# EAGLE design Matrix Clock (EAGLE 6.5.0)
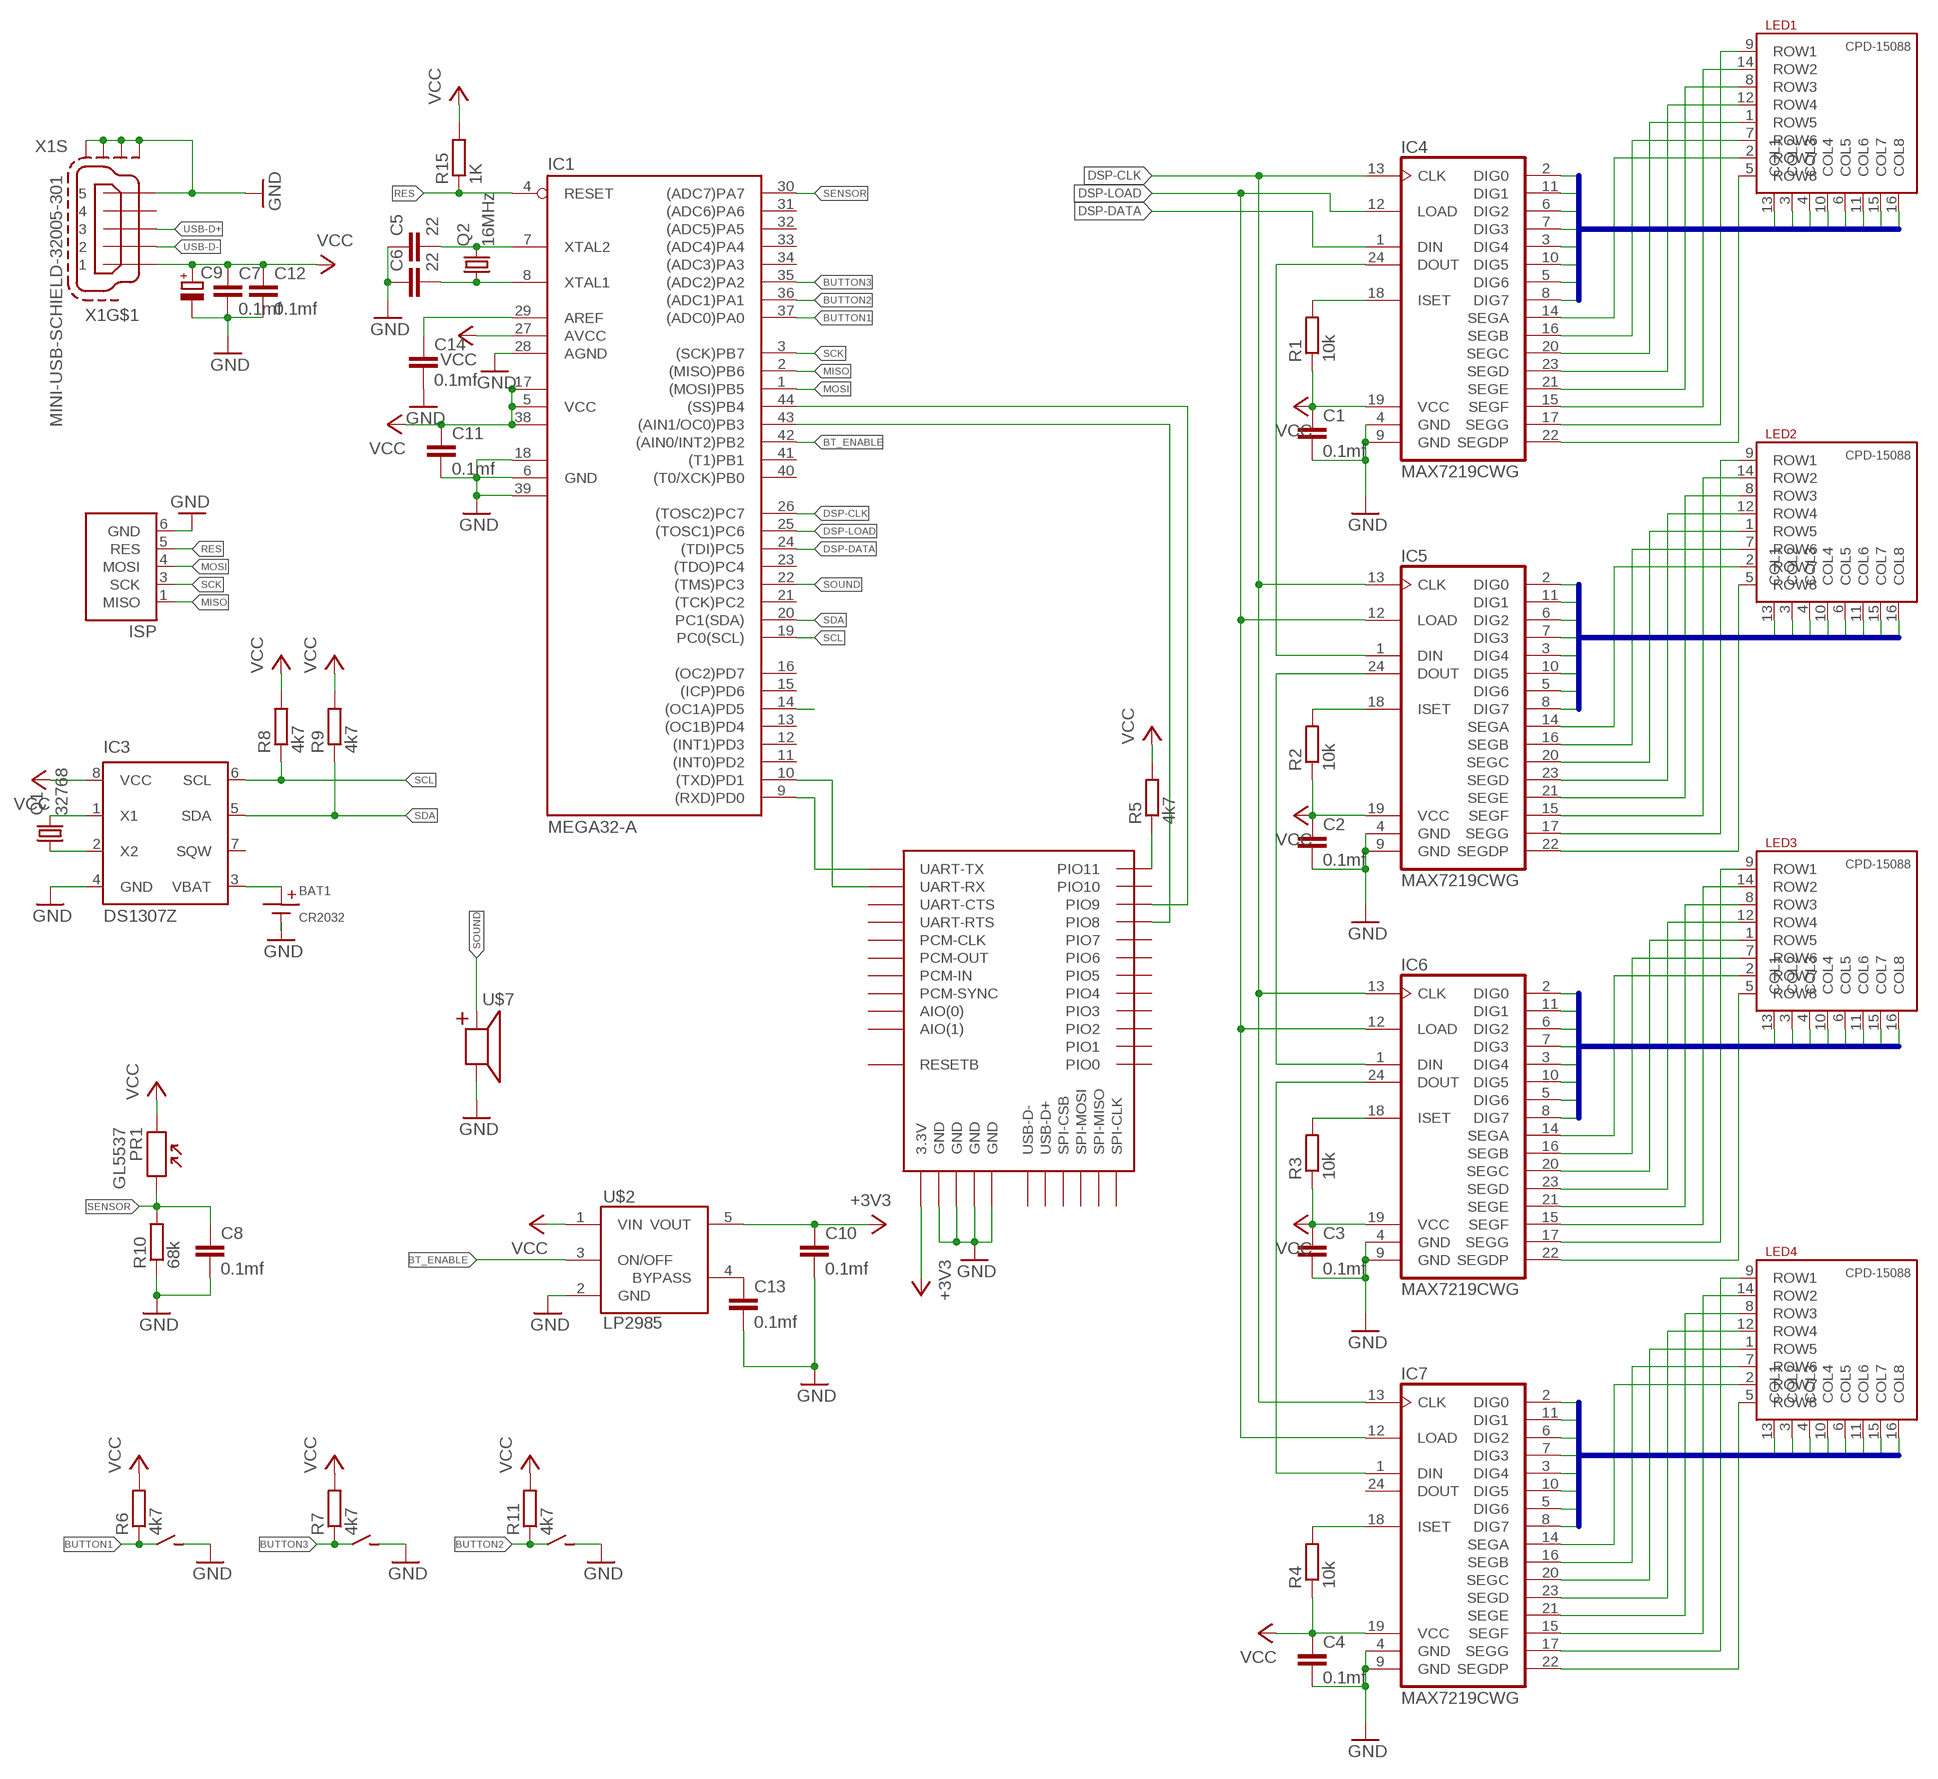
[diagram p0: schematic, sheet 1]

## Parts
BAT1  CR2032  [CR2032-SMD]
C1  0.1mf  C-EUC0805  [C0805]
C2  0.1mf  C-EUC0805  [C0805]
C3  0.1mf  C-EUC0805  [C0805]
C4  0.1mf  C-EUC0805  [C0805]
C5  22  C-EUC0805  [C0805]
C6  22  C-EUC0805  [C0805]
C7  0.1mf  C-EUC0805  [C0805]
C8  0.1mf  C-EUC0805  [C0805]
C9  CPOL-EU153CLV-0605  [153CLV-0605]
C10  0.1mf  C-EUC0805  [C0805]
C11  0.1mf  C-EUC0805  [C0805]
C12  0.1mf  C-EUC0805  [C0805]
C13  0.1mf  C-EUC0805  [C0805]
C14  0.1mf  C-EUC0805  [C0805]
IC1  MEGA32-A  [TQFP44]
IC3  DS1307Z  [SOIC8]
IC4  MAX7219CWG  [SO24L]
IC5  MAX7219CWG  [SO24L]
IC6  MAX7219CWG  [SO24L]
IC7  MAX7219CWG  [SO24L]
LED1  CPD-15088YGD2/A  [CPD15088]
LED2  CPD-15088YGD2/A  [CPD15088]
LED3  CPD-15088YGD2/A  [CPD15088]
LED4  CPD-15088YGD2/A  [CPD15088]
PR1  GL5537  [GL55]
Q1  32768  CRYSTALTC38H  [TC38H]
Q2  16MHz  CRYSTALHC49S  [HC49/S]
R1  10k  R-EU_R0805  [R0805]
R2  10k  R-EU_R0805  [R0805]
R3  10k  R-EU_R0805  [R0805]
R4  10k  R-EU_R0805  [R0805]
R5  4k7  R-EU_R0805  [R0805]
R6  4k7  R-EU_R0805  [R0805]
R7  4k7  R-EU_R0805  [R0805]
R8  4k7  R-EU_R0805  [R0805]
R9  4k7  R-EU_R0805  [R0805]
R10  68k  R-EU_R0805  [R0805]
R11  4k7  R-EU_R0805  [R0805]
R15  1K  R-EU_R0805  [R0805]
U$1  BTM400_6B  [BTM400_6B]
U$2  LP2985AIM5-3.3  [SOT25]
U$3  AVR-ISP  [AVR-ISP]
U$7  HC0905  [HC0905]
U$9  IT1188E  [IT1188E]
U$10  IT1188E  [IT1188E]
U$11  IT1188E  [IT1188E]
X1  MINI-USB-SCHIELD-32005-301  [32005-301]

## Nets
+3V3 [VCC]: C10.1 U$1.3.3V U$2.5(VOUT)
BT_ENABLE: IC1.42((AIN0/INT2)PB2) U$2.3(ON/OFF)
BUTTON1: IC1.37((ADC0)PA0) R6.1 U$9.3
BUTTON2: IC1.36((ADC1)PA1) R11.1 U$10.3
BUTTON3: IC1.14((OC1A)PD5) IC1.35((ADC2)PA2) R7.1 U$11.3
BYPASS: C13.1 U$2.4(BYPASS)
C0 [LED]: IC4.2(DIG0) LED1.13(COL1)
C1 [LED]: IC4.11(DIG1) LED1.3(COL2)
C2 [LED]: IC4.6(DIG2) LED1.4(COL3)
C3 [LED]: IC4.7(DIG3) LED1.10(COL4)
C4 [LED]: IC4.3(DIG4) LED1.6(COL5)
C5 [LED]: IC4.10(DIG5) LED1.11(COL6)
C6 [LED]: IC4.5(DIG6) LED1.15(COL7)
C7 [LED]: IC4.8(DIG7) LED1.16(COL8)
C8 [LED]: IC5.2(DIG0) LED2.13(COL1)
C9 [LED]: IC5.11(DIG1) LED2.3(COL2)
C10 [LED]: IC5.6(DIG2) LED2.4(COL3)
C11 [LED]: IC5.7(DIG3) LED2.10(COL4)
C12 [LED]: IC5.3(DIG4) LED2.6(COL5)
C13 [LED]: IC5.10(DIG5) LED2.11(COL6)
C14 [LED]: IC5.5(DIG6) LED2.15(COL7)
C15 [LED]: IC5.8(DIG7) LED2.16(COL8)
C16 [LED]: IC6.2(DIG0) LED3.13(COL1)
C17 [LED]: IC6.11(DIG1) LED3.3(COL2)
C18 [LED]: IC6.6(DIG2) LED3.4(COL3)
C19 [LED]: IC6.7(DIG3) LED3.10(COL4)
C20 [LED]: IC6.3(DIG4) LED3.6(COL5)
C21 [LED]: IC6.10(DIG5) LED3.11(COL6)
C22 [LED]: IC6.5(DIG6) LED3.15(COL7)
C23 [LED]: IC6.8(DIG7) LED3.16(COL8)
C24 [LED]: IC7.2(DIG0) LED4.13(COL1)
C25 [LED]: IC7.11(DIG1) LED4.3(COL2)
C26 [LED]: IC7.6(DIG2) LED4.4(COL3)
C27 [LED]: IC7.7(DIG3) LED4.10(COL4)
C28 [LED]: IC7.3(DIG4) LED4.6(COL5)
C29 [LED]: IC7.10(DIG5) LED4.11(COL6)
C30 [LED]: IC7.5(DIG6) LED4.15(COL7)
C31 [LED]: IC7.8(DIG7) LED4.16(COL8)
DSP-CLK: IC1.26((TOSC2)PC7) IC4.13(CLK) IC5.13(CLK) IC6.13(CLK) IC7.13(CLK)
DSP-DATA: IC1.24((TDI)PC5) IC4.1(DIN)
DSP-LOAD: IC1.25((TOSC1)PC6) IC4.12(LOAD) IC5.12(LOAD) IC6.12(LOAD) IC7.12(LOAD)
GND [GND]: BAT1.-(GND) C1.2 C2.2 C3.2 C4.2 C5.1 C6.1 C7.2 C8.2 C9.- C10.2 C11.2 C12.2 C13.2 C14.2 IC1.6(GND) IC1.18(GND1) IC1.28(AGND) IC1.39(GND2) IC3.4(GND) IC4.4(GND) IC4.9(GND) IC5.4(GND) IC5.9(GND) IC6.4(GND) IC6.9(GND) IC7.4(GND) IC7.9(GND) R10.1 U$1.GND@1(GND) U$1.GND@2(GND) U$1.GND@3(GND) U$1.GND@4(GND) U$2.2(GND) U$3.6(GND) U$7.P$1 U$9.4 U$10.4 U$11.4 X1.5 X1.M1(S:S1) X1.M2(S:S2) X1.M3(S:S3) X1.M4(S:S4)
MISO: IC1.2((MISO)PB6) U$3.1(MISO)
MOSI: IC1.1((MOSI)PB5) U$3.4(MOSI)
N$1 [LED]: IC4.22(SEGDP) LED1.5(ROW8)
N$2 [VCC]: IC4.18(ISET) R1.2
N$3: BAT1.+(VBAT) IC3.3(VBAT)
N$4: IC1.10((TXD)PD1) U$1.UART-RX
N$5: IC1.9((RXD)PD0) U$1.UART-TX
N$6 [LED]: IC4.17(SEGG) LED1.9(ROW1)
N$7 [LED]: IC4.15(SEGF) LED1.14(ROW2)
N$8 [LED]: IC4.21(SEGE) LED1.8(ROW3)
N$9 [LED]: IC4.23(SEGD) LED1.12(ROW4)
N$10 [LED]: IC4.20(SEGC) LED1.1(ROW5)
N$11 [LED]: IC4.16(SEGB) LED1.7(ROW6)
N$12 [LED]: IC4.14(SEGA) LED1.2(ROW7)
N$13 [VCC]: IC5.18(ISET) R2.2
N$14: IC5.24(DOUT) IC6.1(DIN)
N$15: IC6.24(DOUT) IC7.1(DIN)
N$16: IC4.24(DOUT) IC5.1(DIN)
N$17 [LED]: IC5.22(SEGDP) LED2.5(ROW8)
N$18 [LED]: IC5.17(SEGG) LED2.9(ROW1)
N$19 [LED]: IC5.15(SEGF) LED2.14(ROW2)
N$20 [LED]: IC5.21(SEGE) LED2.8(ROW3)
N$21 [LED]: IC5.23(SEGD) LED2.12(ROW4)
N$22 [LED]: IC5.20(SEGC) LED2.1(ROW5)
N$23 [LED]: IC5.16(SEGB) LED2.7(ROW6)
N$24 [LED]: IC5.14(SEGA) LED2.2(ROW7)
N$25 [VCC]: IC6.18(ISET) R3.2
N$26: IC1.44((SS)PB4) U$1.PIO(9)(PIO9)
N$27: IC1.43((AIN1/OC0)PB3) U$1.PIO(8)(PIO8)
N$28: R5.1 U$1.PIO(11)(PIO11)
N$29 [LED]: IC6.22(SEGDP) LED3.5(ROW8)
N$30 [LED]: IC6.17(SEGG) LED3.9(ROW1)
N$31 [LED]: IC6.15(SEGF) LED3.14(ROW2)
N$32 [LED]: IC6.21(SEGE) LED3.8(ROW3)
N$33 [LED]: IC6.23(SEGD) LED3.12(ROW4)
N$34 [LED]: IC6.20(SEGC) LED3.1(ROW5)
N$35 [LED]: IC6.16(SEGB) LED3.7(ROW6)
N$36 [LED]: IC6.14(SEGA) LED3.2(ROW7)
N$37 [VCC]: IC7.18(ISET) R4.2
N$41 [LED]: IC7.22(SEGDP) LED4.5(ROW8)
N$42 [LED]: IC7.17(SEGG) LED4.9(ROW1)
N$43 [LED]: IC7.15(SEGF) LED4.14(ROW2)
N$44 [LED]: IC7.21(SEGE) LED4.8(ROW3)
N$45 [LED]: IC7.23(SEGD) LED4.12(ROW4)
N$46 [LED]: IC7.20(SEGC) LED4.1(ROW5)
N$47 [LED]: IC7.16(SEGB) LED4.7(ROW6)
N$48 [LED]: IC7.14(SEGA) LED4.2(ROW7)
N$53: IC3.1(X1) Q1.2
N$54: IC3.2(X2) Q1.1
N$55: C14.1 IC1.29(AREF)
RES: IC1.4(RESET) R15.1 U$3.5(RES)
SCK: IC1.3((SCK)PB7) U$3.3(SCK)
SCL: IC1.19(PC0(SCL)) IC3.6(SCL) R8.1
SDA: IC1.20(PC1(SDA)) IC3.5(SDA) R9.1
SENSOR: C8.1 IC1.30((ADC7)PA7) PR1.P$2 R10.2
SOUND: IC1.22((TMS)PC3) U$7.P$2
USB-D+: X1.3
USB-D-: X1.2
VCC [VCC]: C1.1 C2.1 C3.1 C4.1 C7.1 C9.+ C11.1 C12.1 IC1.5(VCC) IC1.17(VCC1) IC1.27(AVCC) IC1.38(VCC2) IC3.8(VCC) IC4.19(VCC) IC5.19(VCC) IC6.19(VCC) IC7.19(VCC) PR1.P$1 R1.1 R2.1 R3.1 R4.1 R5.2 R6.2 R7.2 R8.2 R9.2 R11.2 R15.2 U$2.1(VIN) X1.1
XTAL1: C6.2 IC1.8(XTAL1) Q2.1
XTAL2: C5.2 IC1.7(XTAL2) Q2.2
Unconnected: IC1.11((INT0)PD2) IC1.12((INT1)PD3) IC1.13((OC1B)PD4) IC1.15((ICP)PD6) IC1.16((OC2)PD7) IC1.21((TCK)PC2) IC1.23((TDO)PC4) IC1.31((ADC6)PA6) IC1.32((ADC5)PA5) IC1.33((ADC4)PA4) IC1.34((ADC3)PA3) IC1.40((T0/XCK)PB0) IC1.41((T1)PB1) IC3.7(SQW) IC7.24(DOUT) U$1.AIO(0) U$1.AIO(1) U$1.PCM-CLK U$1.PCM-IN U$1.PCM-OUT U$1.PCM-SYNC U$1.PIO(0)(PIO0) U$1.PIO(1)(PIO1) U$1.PIO(2)(PIO2) U$1.PIO(3)(PIO3) U$1.PIO(4)(PIO4) U$1.PIO(5)(PIO5) U$1.PIO(6)(PIO6) U$1.PIO(7)(PIO7) U$1.PIO(10)(PIO10) U$1.RESETB U$1.SPI-CLK U$1.SPI-CSB U$1.SPI-MISO U$1.SPI-MOSI U$1.UART-CTS U$1.UART-RTS U$1.USB-D+ U$1.USB-D- X1.4

## Buses
C0,C1,C2,C3,C4,C5,C6,C7

## Library data of the parts
BAT1 = misc:CR2032: CR2032 Socket
C1-C8 C10-C14 = rcl:C-EU: CAPACITOR, European symbol
C9 = rcl:CPOL-EU: POLARIZED CAPACITOR, European symbol
IC1 = avr-7:MEGA32: MICROCONTROLLER 32 Kbytes FLASH 2 Kbytes SRAM 1 Kbytes EEPROM USART 8-channel 10 bit ADC
IC3 = ds1307_pcf8583:DS1307: I2C-Bus CLOCK/CALENDAR
IC4-IC7 = max7219:MAX7219CWG
LED1-LED4 = LED:CPD-15088: CPD-15088A YGD2/A Green 8x8 LED matrix
PR1 = misc:GL5537: GL5537 Photoresistor
Q1 = crystal:CRYSTAL: CRYSTAL; OC_FARNELL: unknown; OC_NEWARK: unknown
Q2 = crystal:CRYSTAL: CRYSTAL; OC_FARNELL: 1667008; OC_NEWARK: unknown
R1-R11 R15 = rcl:R-EU_: RESISTOR, European symbol
U$1 = bc417:BTM400_6B
U$2 = LP2985:LP2985: LP2985-N Micropower 150 mA Low-Noise Ultra Low-Dropout Regulator
U$3 = misc:AVR-ISP: ISP Socket for AVR microcontrollers
U$7 = misc:HC0905
U$9-U$11 = misc:IT1188E: IT1188E SMD Tact button
X1 = con-cypressindustries:MINI-USB-SCHIELD-: MINI USB-B Conector Source: www.cypressindustries.com; OC_FARNELL: unknown; OC_NEWARK: unknown

## Net classes
0 default: width 0.203 mm
1 VCC: width 0.5 mm
2 GND: width 0.5 mm
3 LED: width 0.254 mm

## Board
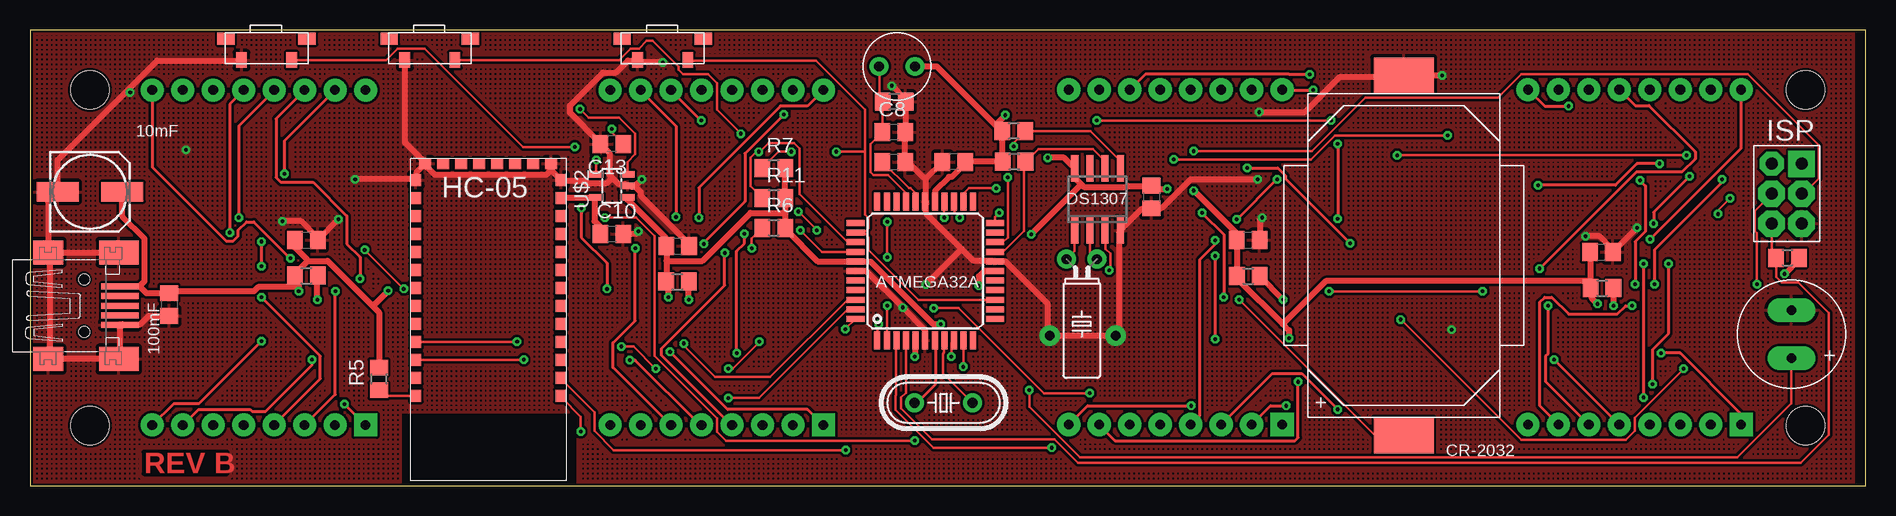
[diagram p1: board, top side]
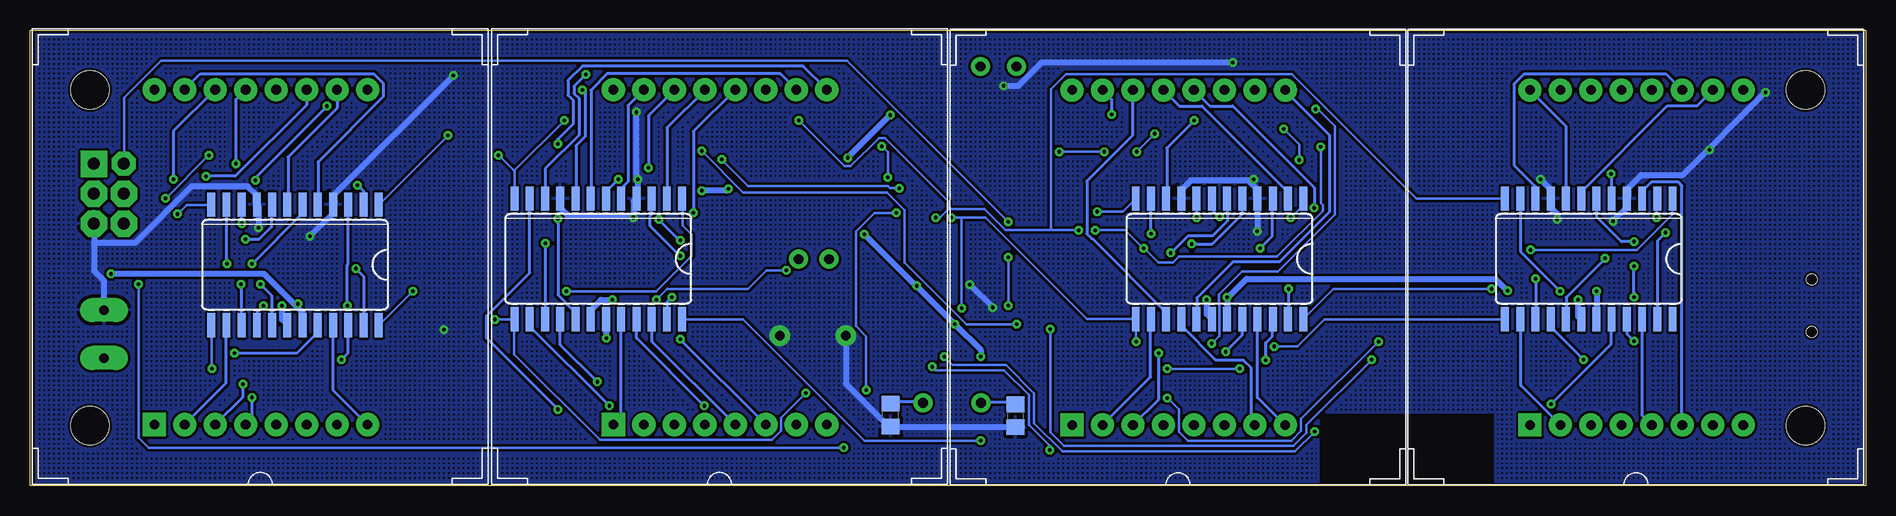
[diagram p2: board, bottom side, seen from below]

Size 153 x 38 mm. Coordinates in mm from the lower left corner, seen from the top.
Outline: 0,0 153,0 153,38 0,38 0,0
Copper layers (1*16): Top 0.035mm / dielectric 1.5mm / Bottom 0.035mm
Design rules "default": minimum track width 8mil, minimum drill 0.3mm, track to track 8mil, track to pad 8mil, pad to pad 8mil, via to via 8mil, smd to smd 0mil, copper to edge 0.2mm, drill to drill 1mm, minimum pad ring 15mil, minimum via ring 8mil, stop-mask expansion 4mil, vias tented up to drill 0mil, thermal gap 0.3mm
Holes 3.2 mm at 5,5 5,33 148,5 148,33
tRestrict: area 31,0 to 45.5,6
bRestrict: area 31,0 to 45.5,6

### Footprints (pad centres in the part's own frame; a part is rotated, then mirrored left to right if it is on the bottom)
CR2032-SMD = smd 3 x 5: + -14.2,0; - 15.8,0
C0805 = smd 1.3 x 1.5: 1 -0.95,0; 2 0.95,0
153CLV-0605 = smd 3.5 x 1.6: + 2.7,0; - -2.7,0
TQFP44 = smd 1.5 x 0.5: 1 -5.8,4; 2 -5.8,3.2; 3 -5.8,2.4; 4 -5.8,1.6; 5 -5.8,0.8; 6 -5.8,0; 7 -5.8,-0.8; 8 -5.8,-1.6; 9 -5.8,-2.4; 10 -5.8,-3.2; 11 -5.8,-4; 23 5.8,-4; 24 5.8,-3.2; 25 5.8,-2.4; 26 5.8,-1.6; 27 5.8,-0.8; 28 5.8,0; 29 5.8,0.8; 30 5.8,1.6; 31 5.8,2.4; 32 5.8,3.2; 33 5.8,4 | smd 0.5 x 1.5: 12 -4,-5.8; 13 -3.2,-5.8; 14 -2.4,-5.8; 15 -1.6,-5.8; 16 -0.8,-5.8; 17 0,-5.8; 18 0.8,-5.8; 19 1.6,-5.8; 20 2.4,-5.8; 21 3.2,-5.8; 22 4,-5.8; 34 4,5.8; 35 3.2,5.8; 36 2.4,5.8; 37 1.6,5.8; 38 0.8,5.8; 39 0,5.8; 40 -0.8,5.8; 41 -1.6,5.8; 42 -2.4,5.8; 43 -3.2,5.8; 44 -4,5.8
SOIC8 = smd 0.6 x 2.2: 1 -1.905,-2.6; 2 -0.635,-2.6; 3 0.635,-2.6; 4 1.905,-2.6; 5 1.905,2.6; 6 0.635,2.6; 7 -0.635,2.6; 8 -1.905,2.6
SO24L = smd 0.66 x 2.032: 1 -6.985,-5.029; 2 -5.715,-5.029; 3 -4.445,-5.029; 4 -3.175,-5.029; 5 -1.905,-5.029; 6 -0.635,-5.029; 7 0.635,-5.029; 8 1.905,-5.029; 9 3.175,-5.029; 10 4.445,-5.029; 11 5.715,-5.029; 12 6.985,-5.029; 13 6.985,5.029; 14 5.715,5.029; 15 4.445,5.029; 16 3.175,5.029; 17 1.905,5.029; 18 0.635,5.029; 19 -0.635,5.029; 20 -1.905,5.029; 21 -3.175,5.029; 22 -4.445,5.029; 23 -5.715,5.029; 24 -6.985,5.029
CPD15088 = drill 0.8 pad 1.93 square: 1 10.16,-33.02 | drill 0.8 pad 1.93: 2 12.7,-33.02; 3 15.24,-33.02; 4 17.78,-33.02; 5 20.32,-33.02; 6 22.86,-33.02; 7 25.4,-33.02; 8 27.94,-33.02; 9 27.94,-5.08; 10 25.4,-5.08; 11 22.86,-5.08; 12 20.32,-5.08; 13 17.78,-5.08; 14 15.24,-5.08; 15 12.7,-5.08; 16 10.16,-5.08
GL55 = drill 0.8: P$1 -1.5,0; P$2 1.5,0
TC38H = drill 0.813: 1 -1.27,0; 2 1.27,0
HC49/S = drill 0.813: 1 -2.413,0; 2 2.413,0
R0805 = smd 1.3 x 1.5: 1 -0.95,0; 2 0.95,0
BTM400_6B = smd 0.9 x 1: 3.3V -6.05,-10.16; AIO(0) -6.05,-5.66; AIO(1) -6.05,-7.16; GND@1 -6.05,-11.66; GND@4 6.05,-11.66; PCM-CLK -6.05,0.34; PCM-IN -6.05,-2.66; PCM-OUT -6.05,-1.16; PCM-SYNC -6.05,-4.16; PIO(0) 6.05,-10.16; PIO(1) 6.05,-8.66; PIO(2) 6.05,-7.16; PIO(3) 6.05,-5.66; PIO(4) 6.05,-4.16; PIO(5) 6.05,-2.66; PIO(6) 6.05,-1.16; PIO(7) 6.05,0.34; PIO(8) 6.05,1.84; PIO(9) 6.05,3.34; PIO(10) 6.05,4.84; PIO(11) 6.05,6.34; RESETB -6.05,-8.66; UART-CTS -6.05,3.34; UART-RTS -6.05,1.84; UART-RX -6.05,4.84; UART-TX -6.05,6.34 | smd 1 x 0.9: GND@2 -5.23,-13; GND@3 5.27,-13; SPI-CLK 2.27,-13; SPI-CSB -2.23,-13; SPI-MISO 0.77,-13; SPI-MOSI -0.73,-13; USB-D+ 3.77,-13; USB-D- -3.73,-13
SOT25 = smd 0.55 x 1.2: 1 -0.95,-1.3; 2 0,-1.3; 3 0.95,-1.3; 4 0.95,1.3; 5 -0.95,1.3
AVR-ISP = drill 1 pad 2 octagon: 1 0,2.5 | drill 1 pad 2.2 square: 2 2.5,2.5 | drill 1 pad 2.2 octagon: 3 0,0; 4 2.5,0; 5 0,-2.5; 6 2.5,-2.5
HC0905 = drill 0.8 pad 2 long: P$1 -2,0; P$2 2,0
IT1188E = smd 1.45 x 1: 1 -0.72,-0.9; 2 6.04,-0.9 | smd 0.9 x 1.3: 3 0.56,0.9; 4 4.74,0.9
32005-301 = smd 3.1 x 0.5: 1 3,1.6; 2 3,0.8; 3 3,0; 4 3,-0.8; 5 3,-1.6 | smd 2.5 x 2: M1 -3,-4.45; M2 -3,4.45 | smd 3.3 x 2: M3 2.9,4.45; M4 2.9,-4.45 | hole 0.9: 0,2.2; 0,-2.2

### Placement (x,y rotation side)
BAT1  114.52,18.4 90 top
C1  130.99,19.47 0 top
C2  101.54,20.47 0 top
C3  53.99,19.97 0 top
C4  23.04,20.47 0 top
C5  70.84,5.82 90 bottom
C6  81.26,5.87 90 bottom
C7  93.49,24.07 270 top
C8  72,29.5 0 top
C9  5,24.5 0 top
C10  48.5,21 0 top
C11  77,27 180 top
C12  11.6,15.1 270 top
C13  48.5,28.5 180 top
C14  72,27 0 top
IC1  74.62,17.9 90 top
IC3  88.98,23.87 0 top
IC4  130.91,18.41 180 bottom
IC5  105.63,18.91 180 bottom
IC6  53.85,18.91 180 bottom
IC7  23.07,18.91 180 bottom
LED1  152.8,38.1 0 bottom
LED2  114.53,38.1 0 bottom
LED3  76.3,38.07 0 bottom
LED4  38.13,38.07 0 bottom
PR1  72.27,34.96 180 top
Q1  87.67,18.88 180 top
Q2  76.15,6.9 180 top
R1  131.03,16.46 0 top
R2  101.55,17.46 0 top
R3  53.97,17.01 0 top
R4  23.04,17.51 0 top
R5  29.1,8.9 90 top
R6  62,21.5 0 top
R7  62,26.5 0 top
R8  82.03,27.01 180 top
R9  82,29.56 180 top
R10  72.04,32.02 180 top
R11  62,24 0 top
R15  146.5,19 0 top
U$1  38.21,13.84 180 top
U$2  48.5,25 90 top
U$3  145.17,24.34 0 top
U$7  146.82,12.64 270 top
U$9  22.37,36.39 180 top
U$10  35.98,36.39 180 top
U$11  55.39,36.39 180 top
X1  4.5,15 0 top

### Tracks (layer width: path | path; a pad name or v marks a point on that pad's centre or on a via)
+3V3
  Top 0.5: U$1.3.3V 44.3,24 47.15,24 U$2.5 47.05,23.8 47.05,22.05 47.55,21.55 C10.1
BT_ENABLE  (via drill 0.3)
  Top 0.203: U$2.3 49.8,27 50.45,27.65 50.45,29.35 49.1,30.7 46.55,30.7 v45.85,31.4 | v54.5,11.85 54.5,11.65 57.1,9.05 61.7,9.05 68.15,15.5 68.8,15.5 IC1.42
  Bottom 0.203: v45.85,31.4 45.65,31.4 44.25,30 44.25,22.6 49,17.85 52,17.85 53.9,15.95 53.9,15.1 53.85,15.05 53.85,12.5 v54.5,11.85
BUTTON1  (via drill 0.3)
  Top 0.203: v45.4,28.25 41.1,28.25 32.9,36.45 30.65,36.45 29.7,35.5 21.85,35.5 U$9.3 | v60.15,19.8 60.15,20.6 R6.1 | v64.2,21.3 66,19.5 68.8,19.5 IC1.37
  Bottom 0.203: v45.4,28.25 45.4,23.55 45.25,23.4 45.25,22.9 49.05,19.1 57.25,19.1 57.75,18.6 58.95,18.6 v60.15,19.8 60.25,19.8 61.75,21.3 v64.2,21.3
BUTTON2  (via drill 0.3)
  Top 0.203: v59.25,29.35 57.25,31.35 57.25,33.55 56.5,34.3 54.45,34.3 54.05,34.7 54.05,34.95 51.9,37.1 51.4,37.1 50.75,36.45 50.05,36.45 49.1,35.5 35.45,35.5 U$10.3 | R11.1 60.05,25 60.05,27.35 60.55,27.85 v60.75,27.85 60.85,27.85 61.55,28.55 63.7,28.55 64.15,28.1 64.15,24.3 68.15,20.3 68.8,20.3 IC1.36
  Bottom 0.203: v60.75,27.85 v59.25,29.35
BUTTON3  (via drill 0.3)
  Top 0.203: 69.6,27.85 69.6,22.6 69.9,22.3 69.9,21.5 69.5,21.1 68.85,21.1 IC1.35 69.55,21.05 69.9,20.7 69.9,19.65 74.05,15.5 80.4,15.5 IC1.14 | 69.6,27.85 69.6,31.35 65.5,35.45 54.85,35.45 U$11.3 | R7.1 62.4,27.85 v63.45,27.85 | v67.2,27.85 69.5,27.85 69.6,27.85
  Bottom 0.203: v67.2,27.85 v63.45,27.85
BYPASS  (via drill 0.3)
  Top 0.203: v47.2,27.15 U$2.4 | v48.5,29.75 48.5,29.45 C13.1
  Bottom 0.203: v47.2,27.15 47.2,28.45 v48.5,29.75
C0  (via drill 0.3)
  Top 0.254: v125.7,25.05 132.15,25.05 133.95,26.85 v135.85,26.85
  Bottom 0.254: v125.7,25.05 125.2,24.55 IC4.2 | v135.85,26.85 135.85,32.2 135.05,33 LED1.13
C1  (via drill 0.3)
  Top 0.254: v136.6,18.5 136.6,12.7 135.25,11.35 v135.25,8.45
  Bottom 0.254: v136.6,18.5 136.6,23.4 IC4.11 | v135.25,8.45 135.25,7.4 137.55,5.1 LED1.3
C2  (via drill 0.3)
  Top 0.254: v134.5,7.35 v134.5,18.5
  Bottom 0.254: v134.5,18.5 130.3,22.7 130.3,23.4 IC4.6 | v134.5,7.35 134.5,5.6 135,5.1 LED1.4
C3
  Bottom 0.254: IC4.7 131.5,23.45 131.5,27.4 127.4,31.5 127.4,33 LED1.10
C4  (via drill 0.3)
  Top 0.254: v126.55,15 126.55,11 126.35,10.8 126.35,8.65 129.9,5.1 LED1.6
  Bottom 0.254: v126.55,15 126.55,18.4 126.5,18.45 126.5,23.4 IC4.3
C5  (via drill 0.3)
  Top 0.254: v135.35,21.85 135.35,22.8 v138.35,25.8
  Bottom 0.254: v135.35,21.85 135.35,23.4 IC4.10 | v138.35,25.8 135.9,25.8 129.95,31.75 129.95,33 LED1.11
C6
  Bottom 0.254: IC4.5 129,27 123.55,32.45 123.55,33.55 124.35,34.35 138.8,34.35 140.1,33.05 LED1.15
C7  (via drill 0.3)
  Top 0.254: v135.05,20.55 142.6,28.1 142.6,33 LED1.16
  Bottom 0.254: v135.05,20.55 133.9,20.55 132.85,21.6 132.85,23.4 IC4.8
C8
  Bottom 0.254: IC5.2 99.9,29.85 96.75,33 LED2.13
C9  (via drill 0.3)
  Top 0.254: v109,6.35 106,9.35 103.55,9.35 99.3,5.1 LED2.3
  Bottom 0.254: v109,6.35 114.95,12.3 114.95,14.15 111.35,17.75 111.35,23.9 IC5.11
C10  (via drill 0.3)
  Top 0.254: v100.6,22.2 v103.95,25.55 | v98.8,20.45 98.8,20.15 97.5,18.85 97.5,5.85 96.75,5.1 LED2.4
  Bottom 0.254: v103.95,25.55 104.95,24.55 104.95,23.95 IC5.6 | v100.6,22.2 98.85,20.45 v98.8,20.45
C11
  Bottom 0.254: IC5.7 106.25,23.95 106.25,33 104.9,34.35 90.45,34.35 89.15,33.05 LED2.10
C12  (via drill 0.3)
  Top 0.254: v98.8,12.2 v98.8,19.15
  Bottom 0.254: v98.8,19.15 101.3,21.65 101.3,22.5 101.2,22.6 101.2,23.9 IC5.3 | v98.8,12.2 91.7,5.1 LED2.6
C13  (via drill 0.3)
  Top 0.254: v106.65,34.3 104.95,34.3 104.9,34.35 93,34.35 91.7,33.05 LED2.11
  Bottom 0.254: v106.65,34.3 107.65,33.3 107.65,32.7 107.25,32.3 107.25,29.25 110.05,26.45 110.05,23.95 IC5.10
C14
  Bottom 0.254: IC5.5 103.7,23.95 103.7,24.8 103.15,25.35 103.15,31.7 101.85,33 LED2.15
C15  (via drill 0.3)
  Top 0.254: v106.95,33 104.4,33 LED2.16
  Bottom 0.254: v106.95,33 106.75,32.8 106.75,29.1 107.5,28.35 107.5,23.95 IC5.8
C16
  Bottom 0.254: IC6.2 48.15,24.5 55.3,31.65 57.2,31.65 58.5,32.95 LED3.13
C17  (via drill 0.3)
  Top 0.254: v59.55,21 59.55,20.2 58.9,19.55 v58.9,11.05
  Bottom 0.254: v59.55,21 59.55,23.9 IC6.11 | v58.9,11.05 58.9,7.2 LED3.3
C18  (via drill 0.3)
  Top 0.254: v57.9,19.4 57.9,16.7 52.65,11.45 52.65,10.85 58.45,5.05 58.5,5.05 LED3.4
  Bottom 0.254: v57.9,19.4 56.45,20.85 54.4,20.85 53.15,22.1 53.15,22.7 53.2,22.75 53.2,23.9 IC6.6
C19  (via drill 0.3)
  Top 0.254: v53.85,22.4 53.85,30 50.9,32.95 LED3.10
  Bottom 0.254: v53.85,22.4 54.45,23 54.45,23.9 IC6.7
C20  (via drill 0.3)
  Top 0.254: v50.45,19.8 50.45,13.75 48.6,11.9 48.6,9.85 53.4,5.05 LED3.6
  Bottom 0.254: v50.45,19.8 49.45,20.8 49.45,23.9 IC6.3
C21  (via drill 0.3)
  Top 0.254: v55.95,30.45 53.45,32.95 LED3.11
  Bottom 0.254: v55.95,30.45 58.25,28.15 58.25,23.95 IC6.10
C22  (via drill 0.3)
  Top 0.254: v56.15,20.15 56.15,20.25 59.6,23.7 59.6,27.7 v62.85,30.95
  Bottom 0.254: v56.15,20.15 54.45,20.15 51.95,22.65 51.95,23.9 IC6.5 | v62.85,30.95 62.85,32.2 63.6,32.95 LED3.15
C23  (via drill 0.3)
  Top 0.254: v55.75,22.35 55.75,24.85 62.55,31.65 64.8,31.65 66.1,32.95 LED3.16
  Bottom 0.254: v55.75,22.35 55.75,23.9 IC6.8
C24  (via drill 0.3)
  Top 0.254: v17.4,22.35 17.4,30 20.35,32.95 LED4.13
  Bottom 0.254: v17.4,22.35 17.4,23.9 IC7.2
C25  (via drill 0.3)
  Top 0.254: v25.45,16.2 25.45,7.6 LED4.3
  Bottom 0.254: v25.45,16.2 28.75,19.5 28.75,23.9 IC7.11
C26  (via drill 0.3)
  Top 0.254: v19.3,18.3 v19.3,20.35 | v19.3,15.7 24.2,10.8 24.2,8.9 LED4.4
  Bottom 0.254: v19.3,20.35 20.35,20.35 22.4,22.4 22.4,23.9 IC7.6 | v19.3,15.7 v19.3,18.3
C27
  Bottom 0.254: IC7.7 23.7,24.5 16.55,31.65 14.05,31.65 12.75,32.95 LED4.10
C28
  Bottom 0.254: IC7.3 18.6,23.95 18.6,24.55 17.85,25.3 15.6,25.3 15.3,25 15.3,5.05 LED4.6
C29
  Bottom 0.254: IC7.10 27.55,23.95 27.55,25 29.3,26.75 29.3,33.5 28.5,34.3 16.6,34.3 15.3,33 LED4.11
C30  (via drill 0.3)
  Top 0.254: v21.2,26 21.2,28.75 25.4,32.95 LED4.15
  Bottom 0.254: v21.2,26 21.2,23.95 IC7.5
C31
  Bottom 0.254: IC7.8 25,23.95 25,30 27.95,32.95 LED4.16
DSP-CLK  (via drill 0.3)
  Top 0.203: v114.25,13.85 124.3,3.8 133,3.8 133.75,4.55 133.75,5.65 v137.85,9.75 | v76.2,22.35 76.2,23.7 IC1.26 | v49.3,11.6 50.3,11.6 v52.15,9.75 | v58.2,9.75 58.55,9.75 v60.8,12 | v88.35,7.7 84.5,7.7 77.4,14.8 v75.35,14.8
  Bottom 0.203: v114.25,13.85 112.65,13.85 IC5.13 112.65,13.75 112.65,10.95 105.5,3.8 91.15,3.8 90.4,4.55 90.4,5.65 v88.35,7.7 | v137.85,9.75 137.85,13.35 IC4.13 | 75.35,22.35 73.35,22.35 64.9,13.9 60.85,13.9 IC6.13 60.8,13.8 v60.8,12 | 75.35,22.35 v76.2,22.35 | v49.3,11.6 47.35,11.6 45.1,13.85 30.1,13.85 IC7.13 | v58.2,9.75 v52.15,9.75 | v75.35,14.8 75.35,22.25 75.35,22.35
DSP-DATA  (via drill 0.3)
  Top 0.203: v80.55,24.8 78.25,24.8 77.85,24.4 77.85,23.7 IC1.24 | v95.35,27.2 106.75,27.2 108.75,29.2 v118.15,29.2
  Bottom 0.203: v80.55,24.8 81.3,24.8 81.5,25 93.15,25 v95.35,27.2 | v118.15,29.2 123.9,23.45 IC4.1
DSP-LOAD  (via drill 0.3)
  Top 0.203: v77.5,22.35 77.05,22.8 77.05,23.7 IC1.25 | v64.05,22.85 v65.6,21.3 | v88.9,30.45 v108.45,30.45 | v140.7,22.65 140.7,22.95 v141.7,23.95 | v113.95,27.55 v138.1,27.55
  Bottom 0.203: v77.5,22.35 77.15,22.35 76.45,23.05 | 76.45,23.05 73.45,23.05 71.7,21.3 67.9,21.3 | v65.6,21.3 67.9,21.3 | v64.05,22.85 61.9,22.85 60.85,23.9 IC6.12 | IC7.12 30.1,23.95 37.45,23.95 47.8,34.3 66.65,34.3 67.9,33.05 67.9,21.4 67.9,21.3 | 112.6,26.3 IC5.12 | v108.45,30.45 112.6,26.3 | v88.9,30.45 85.1,26.65 84.6,26.65 82.25,29 81.75,29 76.45,23.7 76.45,23.15 76.45,23.05 | v140.7,22.65 139.95,23.4 137.9,23.4 IC4.12 | v138.1,27.55 v141.7,23.95 | v113.95,27.55 112.7,26.3 112.6,26.3
GND  (via drill 0.3, 0.8 pad 1.68)
  Top 0.5: C10.2 50.5,21 v50.7,21.2 | v25.7,22.2 24,20.5 C4.2 23.9,20.75 22.6,22.05 v21.05,22.05 | U$1.GND@3 32.9,26.8 32.2,26.1 32.2,25.5 U$1.GND@4 31.95,25.55 v27.1,25.55 | U$10.4 31.25,35.45 31.25,28.6 32.8,27.05 U$1.GND@3 | 43.45,26.3 43.45,26.8 U$1.GND@2 | 43.45,26.3 U$1.GND@1 44.5,25.4 46.2,25.4 46.4,25.2 48.05,25.2 48.35,25.5 48.52,25.68 | 48.52,25.68 48.3,25.9 48.3,27.75 C13.2 47.4,28.7 45,31.1 45,31.7 47.75,34.45 48.85,34.45 49.85,35.45 50.65,35.45 U$11.4 50.85,35.3 v52.75,35.3 | 48.52,25.68 49.05,25.15 49.6,25.15 U$2.2 50.05,24.95 50.45,24.95 | 50.45,24.95 50.9,24.5 50.9,24.2 54.9,20.2 54.9,20 C3.2 | U$1.GND@3 33.05,26.6 33.75,25.9 43,25.9 43.25,26.15 43.45,26.3 | v51,25.55 50.6,25.15 50.45,24.95 | v133.95,21.5 131.95,19.5 C1.2 131.85,19.75 130.8,20.8 v129.65,20.8 | v117.7,34.2 114.55,34.2 BAT1.- 114.3,34.1 109.2,34.1 106.25,31.15 v102.45,31.15 | IC1.6 74.6,12.1 74.6,13 v72.75,14.85 69.7,17.9 68.85,17.9 IC1.39 | 74.65,25.6 74.65,23.7 IC1.28 74.7,23.5 74.7,22.7 77.65,19.75 | C11.2 74.65,25.6 | 74.65,25.6 74.45,25.75 73.2,27 C14.2 72.95,27.2 C8.2 73,29.7 73,32 R10.1 72.95,32.25 v71.85,33.35 | v102.7,22.35 102.5,22.15 102.5,20.5 C2.2 | v102.35,25.55 96.75,25.55 94.35,23.15 93.75,23.15 C7.2 93.45,23.1 92.7,23.1 90.9,21.3 IC3.4 90.8,21.05 90.8,12.85 90.65,12.7 v90.5,12.5 v85,12.5 84.85,12.7 84.85,15.15 81.3,18.7 80.45,18.7 IC1.18 80.2,18.75 78.65,18.75 77.65,19.75 | C12.2 9.9,14.15 9.2,13.45 7.7,13.45 X1.5 7.5,10.75 X1.M4 X1.M1 1.65,10.75 1.65,19.25 X1.M2 | 8.12,32.98 2.3,27.15 C9.- 2.15,24.3 1.5,23.65 X1.M2 | 8.12,32.98 10.6,35.45 17.6,35.45 U$9.4
  Top 0.5: X1.M3 1.8,19.45 X1.M2 | v74.65,16.75 77.5,19.6 77.65,19.75 | v8.35,32.8 8.3,32.8 8.12,32.98
  Bottom 0.5: v50.7,21.2 50.7,23.9 IC6.4 50.8,24.15 50.8,24.8 51.27,25.27 | 51.27,25.27 51.45,25.45 56.25,25.45 57,24.7 57,23.95 IC6.9 | v25.7,22.2 25.7,22.65 26.2,23.15 26.2,23.9 IC7.9 26.35,24.15 26.35,24.8 v27.1,25.55 | v51,25.55 51.1,25.45 51.27,25.27 | 147.65,20.25 147.65,21.8 U$3.6 | 147.65,20.25 147.65,17.9 146.85,17.1 146.85,14.65 U$7.P$1 | v133.95,21.5 133.95,23.3 134.05,23.4 IC4.9 134.2,23.65 134.2,24.3 134.85,24.95 139.55,24.95 144.25,20.25 147.45,20.25 147.65,20.25 | v129.65,20.8 127.75,22.7 127.75,23.4 IC4.4 127.6,23.65 127.6,24.3 v117.7,34.2 | IC5.9 108.8,23.9 108.8,23.2 108.05,22.45 102.9,22.45 v102.7,22.35 102.7,23.7 102.5,23.9 IC5.4 102.35,24.15 v102.35,25.55 102.45,25.75 v102.45,31.15 | v85,12.5 85,8.5 81.6,5.1 81.45,5.1 C6.1 81.05,4.9 70.85,4.9 C5.1 | v52.75,35.3 68.65,35.3 70.6,33.35 v71.85,33.35 | v21.05,22.05 19.9,23.2 19.9,23.9 IC7.4 19.75,24.15 19.75,24.85 18.7,25.9 15.25,25.9 v8.35,32.8 | v74.65,16.75 v72.75,14.85
  other vias: 13,28 118.5,13
  pour Bottom (hatched): 0,38 152.5,38 152.5,0 0,0
  pour Top (hatched): 0,0 152,0 152,38 0,38
MISO  (via drill 0.3)
  Top 0.203: v71.45,15 71.45,12.1 IC1.2 | v71.45,22 v71.45,19.05
  Bottom 0.203: v71.45,19.05 v71.45,15 | v71.45,22 84.9,35.45 142.05,35.45 145.15,32.35 145.15,26.85 U$3.1
MOSI  (via drill 0.3)
  Top 0.203: v70.75,13.45 70.65,13.35 70.65,12.1 IC1.1 | v97,27.9 106.85,27.9 111.3,32.35 122.35,32.35 124.3,34.3 143.2,34.3 149.1,28.4 149.1,25.6 147.85,24.35 147.7,24.35 U$3.4
  Bottom 0.203: v70.75,13.45 74.95,13.45 80.1,18.6 80.1,23 81.55,24.45 93.55,24.45 v97,27.9
N$1  (via drill 0.3)
  Top 0.254: v127.05,10.5 132.45,5.1 LED1.5
  Bottom 0.254: v127.05,10.5 126.5,11.05 126.5,13.35 IC4.22
N$2  (via drill 0.3)
  Top 0.5: v132,15 132,16.45 R1.2
  Bottom 0.5: v132,15 132,13.85 131.55,13.4 IC4.18
N$3  (via drill 0.3)
  Top 0.203: v89.95,17.95 90.05,18.05 90.05,19.35 89.65,19.75 89.65,21.25 IC3.3 | v100.8,15.5 112.1,4.2 114.5,4.2 BAT1.+
  Bottom 0.203: v89.95,17.95 91.6,17.95 93.15,16.4 99.9,16.4 v100.8,15.5
N$4  (via drill 0.3)
  Top 0.203: v68,2.95 48.65,2.95 47.05,4.55 47.05,6.1 44.3,8.85 44.3,9 U$1.UART-RX | v77.8,9.9 77.8,12.1 IC1.10
  Bottom 0.203: v68,2.95 68,3.3 69.75,5.05 69.75,7.55 71.8,9.6 77.5,9.6 v77.8,9.9
N$5  (via drill 0.3)
  Top 0.203: v45.9,4.5 45.9,5.75 44.3,7.35 44.3,7.5 U$1.UART-TX | v76.8,10.75 76.8,11.9 77,12.1 IC1.9
  Bottom 0.203: v45.9,4.5 47.55,2.85 66.95,2.85 69.3,5.2 69.3,7.7 71.65,10.05 76.1,10.05 v76.8,10.75
N$6  (via drill 0.3)
  Top 0.254: v133.8,16.8 133.8,20.35 134.65,21.2 134.65,25 v134.2,25.45 | v128.25,31.65 126.25,31.65 124.9,33 LED1.9
  Bottom 0.254: v133.8,16.8 132.85,15.85 132.85,13.4 IC4.17 | v134.2,25.45 134.2,25.7 v128.25,31.65
N$7  (via drill 0.3)
  Top 0.254: v135.4,16.8 135.4,19.65 141.05,25.3 v141.05,25.55
  Bottom 0.254: v135.4,16.8 135.4,13.4 IC4.15 | v141.05,25.55 141.05,29.55 137.6,33 LED1.14
N$8
  Bottom 0.254: IC4.21 127.75,13.35 127.75,7.95 124.9,5.1 LED1.8
N$9  (via drill 0.3)
  Top 0.254: v125.85,18.1 133.9,26.15 137.7,26.15 138.8,27.25 138.8,27.85 134.95,31.7 133.8,31.7 132.5,33 LED1.12
  Bottom 0.254: v125.85,18.1 125.2,17.45 125.2,13.4 IC4.23
N$10  (via drill 0.3)
  Top 0.254: v135.95,11.05 137.55,11.05 142.6,6 142.6,5.1 LED1.1
  Bottom 0.254: v135.95,11.05 130.75,11.05 129.05,12.75 129.05,13.35 IC4.20
N$11  (via drill 0.3)
  Top 0.254: v133.55,15 133,15 132.3,14.3 128.25,14.3 126.85,15.7 126.25,15.7 125.85,15.3 125.85,6.65 127.4,5.1 LED1.7
  Bottom 0.254: v133.55,15 134.05,14.5 134.05,13.4 IC4.16
N$12
  Bottom 0.254: IC4.14 136.65,13.35 136.65,8.55 140.1,5.1 LED1.2
N$13  (via drill 0.3)
  Top 0.5: v104.45,15.5 R2.2
  Bottom 0.5: v104.45,15.5 105.4,15.5 106.25,14.65 106.25,13.9 IC5.18
N$14  (via drill 0.3)
  Top 0.203: v47.9,22.35 50.5,22.35 52.05,20.8 52.05,10.8 57.25,5.6 57.25,4.5 58,3.75 v73.75,3.75
  Bottom 0.203: v47.9,22.35 46.9,23.35 46.9,23.9 IC6.1 | v73.75,3.75 83.45,3.75 93.55,13.85 98.6,13.85 IC5.24
N$15  (via drill 0.3)
  Top 0.203: v31.15,16.4 v27.9,19.65
  Bottom 0.203: v27.9,19.65 19.05,19.65 16.1,22.6 16.1,23.9 IC7.1 | v31.15,16.4 44.35,16.4 46.85,13.9 IC6.24
N$16  (via drill 0.3)
  Top 0.203: v121.1,16.2 v108.3,16.2
  Bottom 0.203: v108.3,16.2 100.8,16.2 97.85,19.15 97.85,20.95 98.6,21.7 98.6,23.9 IC5.1 | v121.1,16.2 123.9,13.4 IC4.24
N$17
  Bottom 0.254: IC5.22 101.15,13.85 101.15,12 94.25,5.1 LED2.5
N$18  (via drill 0.3)
  Top 0.254: v109,28.5 v109,22.25
  Bottom 0.254: v109,22.25 109,15.9 107.55,14.45 107.55,13.9 IC5.17 | v109,28.5 109,28.9 107.75,30.15 107.75,32.15 108.15,32.55 108.15,33.8 106.95,35 88.55,35 86.6,33.05 LED2.9
N$19  (via drill 0.3)
  Top 0.254: v110.05,20.2 104.65,25.6 104.65,25.85 104,26.5 v101.45,26.5
  Bottom 0.254: v110.05,20.2 110.05,13.9 IC5.15 | v101.45,26.5 101.45,30.85 99.3,33 LED2.14
N$20  (via drill 0.3)
  Top 0.254: v96.8,6.65 88.15,6.65 86.6,5.1 LED2.8
  Bottom 0.254: v96.8,6.65 102.45,12.3 102.45,13.85 IC5.21
N$21  (via drill 0.3)
  Top 0.254: v99.5,15.7 99.5,20.95 v97.7,22.75
  Bottom 0.254: v99.5,15.7 99.9,15.3 99.9,13.9 IC5.23 | v97.7,22.75 97.7,29.55 94.25,33 LED2.12
N$22
  Bottom 0.254: IC5.20 103.75,13.85 103.75,5.7 104.35,5.1 LED2.1
N$23  (via drill 0.3)
  Top 0.254: v105.7,8.65 105.7,4 105.45,3.75 90.45,3.75 89.15,5.05 LED2.7
  Bottom 0.254: v105.7,8.65 108.8,11.75 108.8,13.85 IC5.16
N$24  (via drill 0.3)
  Top 0.254: v104.7,6.65 103.4,6.65 101.85,5.1 LED2.2
  Bottom 0.254: v104.7,6.65 111.3,13.25 111.3,13.85 IC5.14
N$25  (via drill 0.3)
  Top 0.5: v54.9,15.5 54.9,17 R3.2
  Bottom 0.5: v54.9,15.5 54.9,14.3 54.5,13.9 IC6.18
N$26  (via drill 0.3)
  Top 0.203: v41.15,10.5 32.2,10.5 U$1.PIO(9) | v67.95,13.05 68.8,13.9 IC1.44
  Bottom 0.203: v41.15,10.5 46.6,5.05 46.6,4.4 47.7,3.3 66.8,3.3 67.95,4.45 v67.95,13.05
N$27  (via drill 0.3)
  Top 0.203: v40.6,12 32.2,12 U$1.PIO(8) | v58.2,7.3 60.75,7.3 68.15,14.7 68.8,14.7 IC1.43
  Bottom 0.203: v40.6,12 47.05,5.55 47.05,4.55 47.85,3.75 56.5,3.75 57.25,4.5 57.25,6.35 v58.2,7.3
N$28
  Top 0.203: R5.1 29.55,7.5 U$1.PIO(11)
N$29  (via drill 0.3)
  Top 0.254: v50,10.45 50.45,10.45 55.85,5.05 55.95,5.05 LED3.5
  Bottom 0.254: v50,10.45 50,11.9 49.45,12.45 49.45,13.85 IC6.22
N$30
  Bottom 0.254: IC6.17 55.75,13.9 55.75,15.65 52.75,18.65 48.85,18.65 44.7,22.8 44.7,29.25 48.4,32.95 LED3.9
N$31
  Bottom 0.254: IC6.15 58.3,13.9 58.3,14.45 64.45,20.6 64.5,20.6 64.9,21 64.9,25.4 61.1,29.2 61.1,32.95 LED3.14
N$32
  Bottom 0.254: IC6.21 50.7,13.85 50.7,7.35 48.4,5.05 LED3.8
N$33  (via drill 0.3)
  Top 0.254: v48.1,16.4 48.1,18.55 45.95,20.7 v45.95,23.15
  Bottom 0.254: v48.1,16.4 48.1,13.9 IC6.23 | v45.95,23.15 45.95,24.85 52.75,31.65 54.65,31.65 55.95,32.95 LED3.12
N$34  (via drill 0.3)
  Top 0.254: v53.35,11.15 58.15,6.35 64.8,6.35 66.1,5.05 LED3.1
  Bottom 0.254: v53.35,11.15 51.95,12.55 51.95,13.85 IC6.20
N$35
  Bottom 0.254: LED3.7 51.2,5.35 51.2,9.8 51.85,10.45 54.15,10.45 57,13.3 57,13.85 IC6.16
N$36
  Bottom 0.254: LED3.2 59.6,9.05 59.6,13.85 IC6.14
N$37  (via drill 0.3)
  Top 0.5: v23.95,15.5 23.95,17.5 R4.2
  Bottom 0.5: v23.95,15.5 23.95,14.1 23.75,13.9 IC7.18
N$41
  Bottom 0.254: IC7.22 18.6,13.85 18.6,5.8 17.85,5.05 LED4.5
N$42  (via drill 0.3)
  Top 0.254: v21.7,18.95 18.65,22 18.05,22 17.35,21.3 17.35,20.8 16.95,20.4 16.35,20.4 10.2,26.55 10.2,32.95 LED4.9
  Bottom 0.254: v21.7,18.95 24.95,15.7 24.95,13.9 IC7.17
N$43  (via drill 0.3)
  Top 0.254: v27.5,17.25 27.5,19.05 26.4,20.15 26.4,22.5 23.6,25.3 20.9,25.3 20.5,25.7 20.5,30.6 22.85,32.95 LED4.14
  Bottom 0.254: v27.5,17.25 27.5,13.9 IC7.15
N$44  (via drill 0.3)
  Top 0.254: v19.3,12.05 14.1,6.85 12,6.85 LED4.8
  Bottom 0.254: v19.3,12.05 19.85,12.6 19.85,13.85 IC7.21
N$45  (via drill 0.3)
  Top 0.254: v16.65,21.1 16.65,31.8 17.8,32.95 LED4.12
  Bottom 0.254: v16.65,21.1 17.35,20.4 17.35,13.9 IC7.23
N$46  (via drill 0.3)
  Top 0.254: v26.2,6.8 27.95,5.05 LED4.1
  Bottom 0.254: v26.2,6.8 21.2,11.8 21.2,13.85 IC7.20
N$47  (via drill 0.3)
  Top 0.254: v23.5,10.5 23.5,10.05 19.65,6.2 18.5,6.2 18.35,6.35 14.05,6.35 12.75,5.05 LED4.7
  Bottom 0.254: v23.5,10.5 26.2,13.2 26.2,13.85 IC7.16
N$48
  Bottom 0.254: IC7.14 28.75,13.85 28.75,8.35 25.45,5.05 LED4.2
N$53
  Top 0.203: IC3.1 87.05,21.25 87.05,19.55 86.4,18.9 Q1.2
N$54
  Top 0.203: IC3.2 88.35,21.25 88.35,19.45 88.9,18.9 Q1.1
N$55
  Top 0.203: C14.1 73.25,24.8 73.4,24.8 73.8,24.4 73.8,23.7 IC1.29
RES
  Top 0.203: U$3.5 145.2,21.8 145.2,19.45 145.55,19.1 R15.1 145.55,18.9 145.55,17.4 146,16.95 147.4,16.95 149.95,14.4 149.95,4.25 147.6,1.9 87.35,1.9 85.4,3.85 75.2,3.85 72.6,6.45 72.6,7.35 73,7.75 73,12.1 IC1.4
SCK  (via drill 0.3)
  Top 0.203: v85.15,3.15 75.3,3.15 72.15,6.3 72.15,7.5 72.2,7.55 72.2,12.1 IC1.3 | v143.95,16.8 143.95,21.05 143.75,21.25 143.75,22.9 145.15,24.3 U$3.3
  Bottom 0.203: v85.15,3.15 143.1,3.15 143.95,4 v143.95,16.8
SCL
  Top 0.203: IC1.19 80.45,19.5 81.1,19.5 82.85,21.25 82.85,26.9 82.95,27 R8.1 83.05,27.05 84.05,28.05 88.6,28.05 89.6,27.05 89.6,26.5 IC3.6
SDA  (via drill 0.3)
  Top 0.203: v81.5,25.7 81.5,20.7 81.1,20.3 80.45,20.3 IC1.20 | v82,28.3 82,28.6 R9.1 83.05,29.55 88.4,29.55 90.85,27.1 90.85,26.5 IC3.5
  Bottom 0.203: v81.5,25.7 81.5,27.8 v82,28.3
SENSOR
  Top 0.203: IC1.30 73,23.7 73,24.4 71.5,25.9 70.3,25.9 70.05,26.15 70.05,28.5 C8.1 71.05,29.6 71.05,32 R10.2 71.05,32.1 70.8,32.35 70.8,34.95 PR1.P$2
SOUND  (via drill 0.3)
  Top 0.203: v80.8,22.75 80.45,22.4 80.45,21.9 IC1.22 | v83.3,7.95 83.3,6.55 87.5,2.35 142.3,2.35 146.8,6.85 146.8,10.6 U$7.P$2
  Bottom 0.203: v80.8,22.75 82.6,22.75 84.15,21.2 84.15,13.3 83.3,12.45 v83.3,7.95
VCC  (via drill 0.3)
  Top 0.5: v104.95,12.3 104.95,12.95 104.42,13.47 | 104.42,13.47 100.65,17.25 R2.1 100.6,17.5 100.6,20.45 C2.1 100.5,20.7 100.5,21.1 v97,24.6 | R1.1 130.05,16.5 130.05,19.45 C1.1 | R15.2 147.45,18.85 v146.25,17.65 | v130.65,15.15 130.2,15.6 130.2,16.25 R1.1 | 104.42,13.47 104.6,13.65 108,17.05 129.85,17.05 R1.1 | R5.2 29.1,14.45 28.57,14.97 | 28.57,14.97 24.8,18.75 23.15,18.75 | 23.15,18.75 22.1,17.7 22.1,17.55 R4.1 22.3,17.35 22.4,17.25 22.4,16.55 | C4.1 22.1,20.45 22.1,19.85 23,18.95 23.15,18.75 | 22.4,16.55 v22.4,16.2 | 62.95,22.75 R11.2 62.95,24.2 R7.2 | 62.95,22.75 R6.2 63.05,21.3 65.65,18.7 68.8,18.7 IC1.38 69.05,18.65 70.1,18.65 75.3,13.45 v75.9,13.45 | U$2.1 49.8,23.85 53,20.65 53,20 C3.1 53.05,19.75 53.05,18.75 | 53.05,18.75 53.05,17.05 R3.1 53.2,16.85 v53.2,15.7 | 62.95,22.75 62.75,22.75 60.05,22.75 56.05,18.75 53.25,18.75 53.05,18.75 | R9.2 81.05,27.05 R8.2 80.8,27.05 78.15,27.05 C11.1 77.95,26.85 76.85,25.75 76.6,25.75 75.45,24.6 75.45,23.7 IC1.27 | PR1.P$1 73.8,34.95 75.6,34.95 80.85,29.7 R9.2 | 87.62,25.12 87.1,25.65 87.1,26.45 IC3.8 86.9,26.65 86.2,27.35 v84.85,27.35 | 87.62,25.12 87.85,24.9 91.4,24.9 91.5,25 93.45,25 C7.1 93.7,24.9 93.85,24.75 v94.8,24.75 | v73.75,10.75 73.8,10.8 73.8,12.1 IC1.5 | v79.1,16.65 79.1,17.45 79.55,17.9 80.4,17.9 IC1.17 | v83.45,20.95 87.45,24.95 87.62,25.12 | v81.3,30.9 80.65,30.25 R9.2 | v29.85,16.25 28.75,15.15 28.57,14.97 | 9.15,16.6 9.7,16.05 C12.1 11.8,16.2 18.65,16.2 19,16.55 22.2,16.55 22.4,16.55 | X1.1 9.15,16.6 | C9.+ 7.7,22.45 9.55,20.6 9.55,17.05 9.3,16.8 9.15,16.6
  Bottom 0.5: v104.95,12.3 104.95,13.85 IC5.19 | v146.25,17.65 133.5,17.65 130.82,14.97 | 130.82,14.97 130.3,14.45 130.3,13.4 IC4.19 | v130.65,15.15 130.82,14.97 | v22.4,16.2 22.4,13.9 IC7.19 | IC6.19 53.2,13.9 v53.2,15.7 53,15.85 51.6,17.25 30.85,17.25 v29.85,16.25 | v73.75,10.75 73.75,11.3 v75.9,13.45 v79.1,16.65 79.3,16.8 v83.45,20.95 | v84.85,27.35 v81.3,30.9 | v97,24.6 94.95,24.6 v94.8,24.75
XTAL1
  Top 0.203: IC1.8 76.2,12.1 76.2,11.1 76.1,11 76.1,9.35 Q2.1
  Bottom 0.254: C6.2 81,7 79,7 Q2.1
XTAL2
  Top 0.254: IC1.7 75.5,12 75.5,8.5 74,7 Q2.2
  Bottom 0.254: C5.2 71,7 73.5,7 Q2.2

### Text on the board
Top: REV B
tNames: 10mF | ISP | HC-05 | DS1307 | ATMEGA32A | 100mF | CR-2032